# Altium schematic sheet Copy of ARmed Schematic template 1.SchDoc-revHEAD.svn000.tmp.SchDoc
size B; CompanyName: ARmed; SheetNumber: 1; SheetTotal: 1
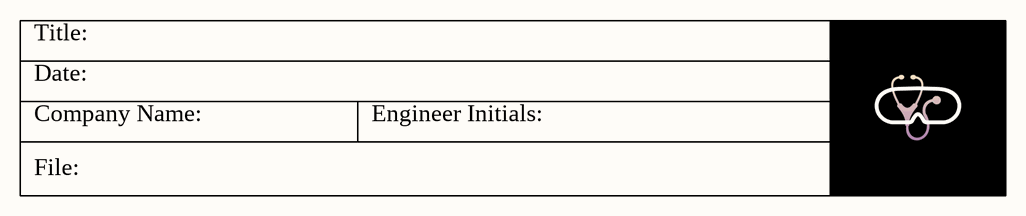
[diagram p0: Copy of ARmed Schematic template 1.SchDoc-revHEAD.svn000.tmp.SchDoc]

## Notes on the sheet
- Title:
- Date:
- Company Name:
- File:
- Engineer Initials: